# Altium schematic sheet Top.SchDoc
size A; SheetNumber: 1; SheetTotal: 3
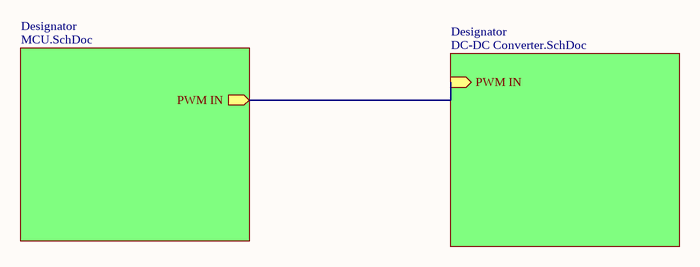
[diagram p0: Top.SchDoc]

## Sub-sheets
Designator = DC-DC Converter.SchDoc: PWM IN (in)
Designator = MCU.SchDoc: PWM IN (out)

## Nets
(unnamed): sheet Designator/PWM IN, sheet Designator/PWM IN